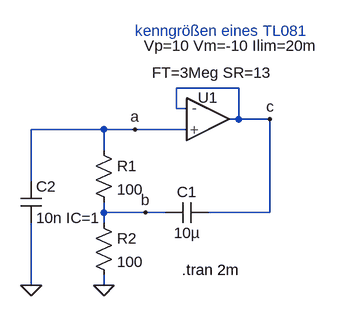
[diagram p0: schematic spulenersatz.asc]
spulenersatz.asc, the LTspice schematic file:
Version 4
SHEET 1 880 680
WIRE 432 -16 336 -16
WIRE 336 16 336 -16
WIRE 352 16 336 16
WIRE 432 32 432 -16
WIRE 432 32 416 32
WIRE 480 32 432 32
WIRE 224 48 112 48
WIRE 272 48 224 48
WIRE 352 48 272 48
WIRE 224 80 224 48
WIRE 112 128 112 48
WIRE 224 176 224 160
WIRE 288 176 224 176
WIRE 320 176 288 176
WIRE 480 176 480 32
WIRE 480 176 384 176
WIRE 224 192 224 176
WIRE 112 288 112 192
WIRE 224 288 224 272
FLAG 224 288 0
FLAG 112 288 0
FLAG 272 48 a
FLAG 288 176 b
FLAG 480 32 c
SYMBOL res 208 64 R0
SYMATTR InstName R1
SYMATTR Value 100
SYMBOL res 208 176 R0
SYMATTR InstName R2
SYMATTR Value 100
SYMBOL cap 384 160 R90
WINDOW 0 0 32 VBottom 2
WINDOW 3 32 32 VTop 2
SYMATTR InstName C1
SYMATTR Value 10µ
SYMBOL cap 96 128 R0
SYMATTR InstName C2
SYMATTR Value 10n IC=1
SYMBOL EIT_Semiconductors\\op_3 384 32 R0
WINDOW 123 -86 -72 Left 2
WINDOW 3 -98 -113 Left 2
SYMATTR InstName U1
SYMATTR Value2 FT=3Meg SR=13
TEXT 344 264 Left 2 !.tran 2m
TEXT 272 -104 Left 2 ;kenngrößen eines TL081

The netlist it stands for:
* spulenersatz.asc
R1 a b 100
R2 b 0 100
C1 c b 10µ
C2 a 0 10n IC=1
XU1 a c c opamp_param_3 Vp=10 Vm=-10 Ilim=20m FT=3Meg SR=13 Vos=0 A0=100k phir=45 en=0 enk=0 in=0 ink=0 Rin=500Meg  ; pins In+ In- OUT
.tran 2m
* kenngrößen eines TL081
.lib EIT_sub\opamp_parametrierbar.sub
.backanno
.end